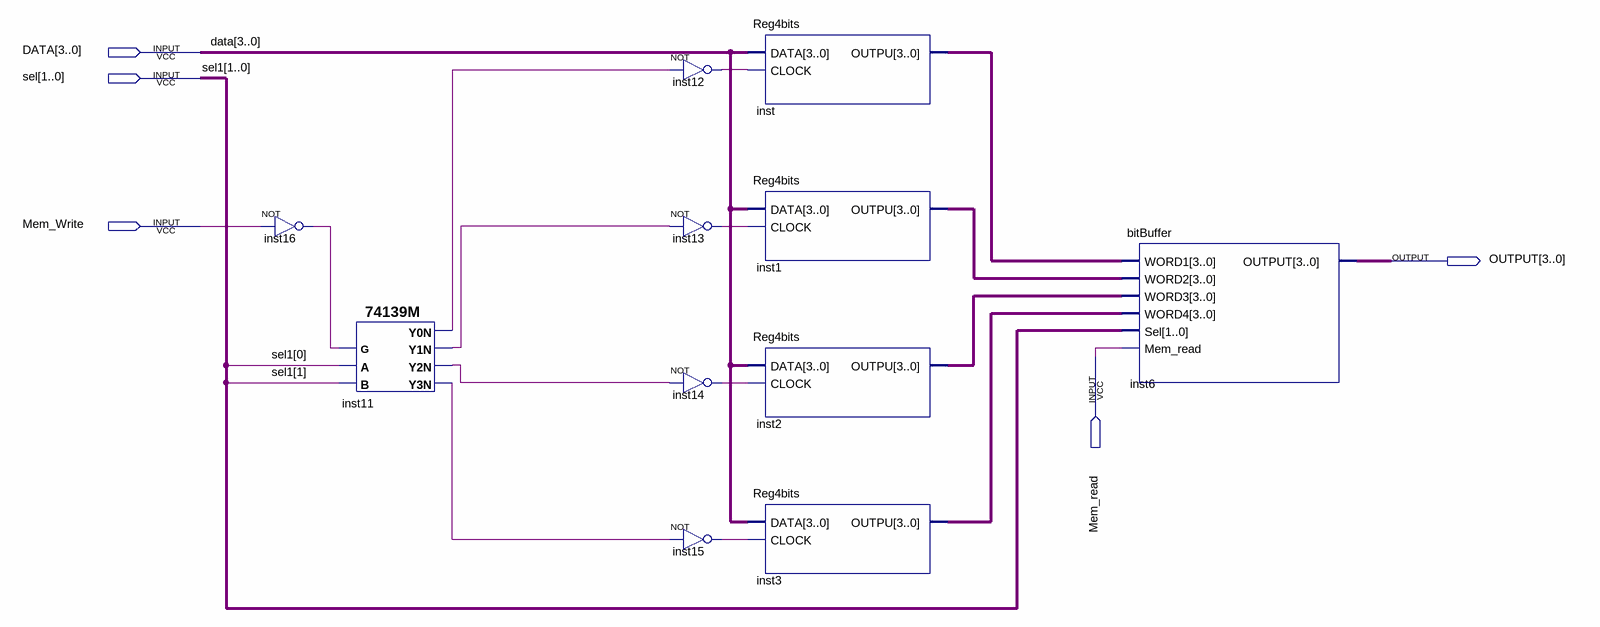
[diagram p0: schematic sheet]
// Quartus schematic Memoria.bdf as structural Verilog: 11 symbols, 5 pins
module Memoria (
  input  [3:0] DATA,
  input  [1:0] sel,
  input  Mem_Write,
  input  Mem_read,
  output [3:0] OUTPUT
);

  wire inst11_y0n, inst11_y1n, inst11_y2n, inst11_y3n, inst12_out, inst13_out, inst14_out, inst15_out,
       inst16_out;
  wire [3:0] inst1_outpu, inst2_outpu, inst3_outpu, inst_outpu;

  not inst16 (inst16_out, Mem_Write);
  \74139M  inst11 (
    .B(sel[1]), .A(sel[0]), .G(inst16_out), .Y3N(inst11_y3n), .Y2N(inst11_y2n), .Y0N(inst11_y0n),
    .Y1N(inst11_y1n));
  not inst12 (inst12_out, inst11_y0n);
  not inst13 (inst13_out, inst11_y1n);
  not inst14 (inst14_out, inst11_y2n);
  not inst15 (inst15_out, inst11_y3n);
  Reg4bits inst (.DATA(DATA), .CLOCK(inst12_out), .OUTPU(inst_outpu));
  Reg4bits inst1 (.DATA(DATA), .CLOCK(inst13_out), .OUTPU(inst1_outpu));
  Reg4bits inst2 (.DATA(DATA), .CLOCK(inst14_out), .OUTPU(inst2_outpu));
  Reg4bits inst3 (.DATA(DATA), .CLOCK(inst15_out), .OUTPU(inst3_outpu));
  bitBuffer inst6 (
    .WORD1(inst_outpu), .WORD2(inst1_outpu), .WORD3(inst2_outpu), .WORD4(inst3_outpu), .Sel(sel),
    .Mem_read(Mem_read), .OUTPUT(OUTPUT));

  // Other names for the same wires on the sheet: sel1[1:0] = sel
endmodule
